# Altium schematic sheet Dual Polarity Power Supply.schdoc: Dual Polarity Power Supply
size A4; Organization: Altium Limited; Address1: L3, 12a Rodborough Rd; Address2: Frenchs Forest; Address3: NSW; Address4: Australia 2086; DocumentNumber: 1; SheetNumber: 1; SheetTotal: 1
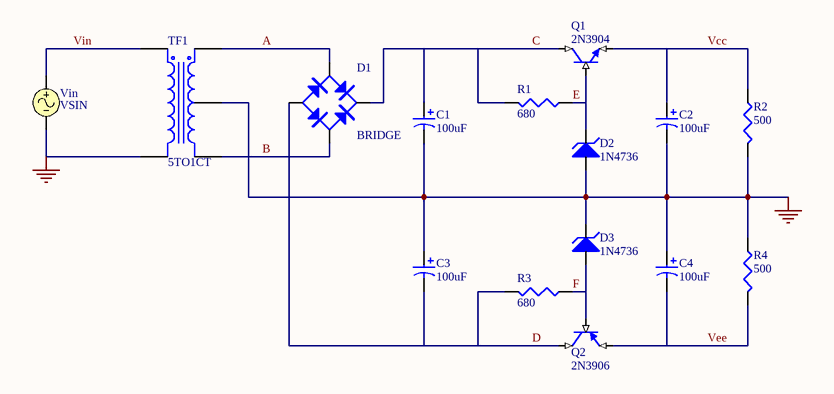
[diagram p0: Dual Polarity Power Supply.schdoc]

## Parts
C1  100uF
C2  100uF
C3  100uF
C4  100uF
D1  BRIDGE
D2  1N4736
D3  1N4736
Q1  2N3904
Q2  2N3906
R1  680
R2  500
R3  680
R4  500
TF1  5TO1CT
Vin  VSIN

## Nets
GND: C1.2 C2.2 C3.1 C4.1 D2.1(A) D3.2(K) R2.1(TOP) R4.2(BOT) TF1.2(Pri-) TF1.4(SecCT) Vin.2
A: D1.2(AC) TF1.3(Sec+)
B: D1.4(AC) TF1.5(Sec-)
C: C1.1 D1.3(V+) Q1.1(C) R1.1(TOP)
D: C3.2 D1.1(V-) Q2.1(C) R3.1(TOP)
E: D2.2(K) Q1.2(B) R1.2(BOT)
F: D3.1(A) Q2.2(B) R3.2(BOT)
Vcc: C2.1 Q1.3(E) R2.2(BOT)
Vee: C4.2 Q2.3(E) R4.1(TOP)
Vin: TF1.1(Pri+) Vin.1

## Notes on the sheet
- Title
- Size:
- Date:
- A4
- Number:
- Time:
- Revision:
- Sheet
- of
- File:

## Library data of the parts
C1-C4 = CAP2: Bi-Polar Capacitor; Value: 100uF
D1 = BRIDGE: Diode Bridge
D2 D3 = 1N4736: Zener Diode
Q1 = 2N3904: NPN BJT
Q2 = 2N3906: PNP BJT
R1-R4 = RES: Resistor
  R1 R3: Value: 680
  R2 R4: Value: 500
TF1 = 5TO1CT: Center-Tapped Transformer
Vin = VSIN: Sinusoidal Voltage Source